# Altium project [MarvBit]STM32_BLDC_ESC.PrjPcb
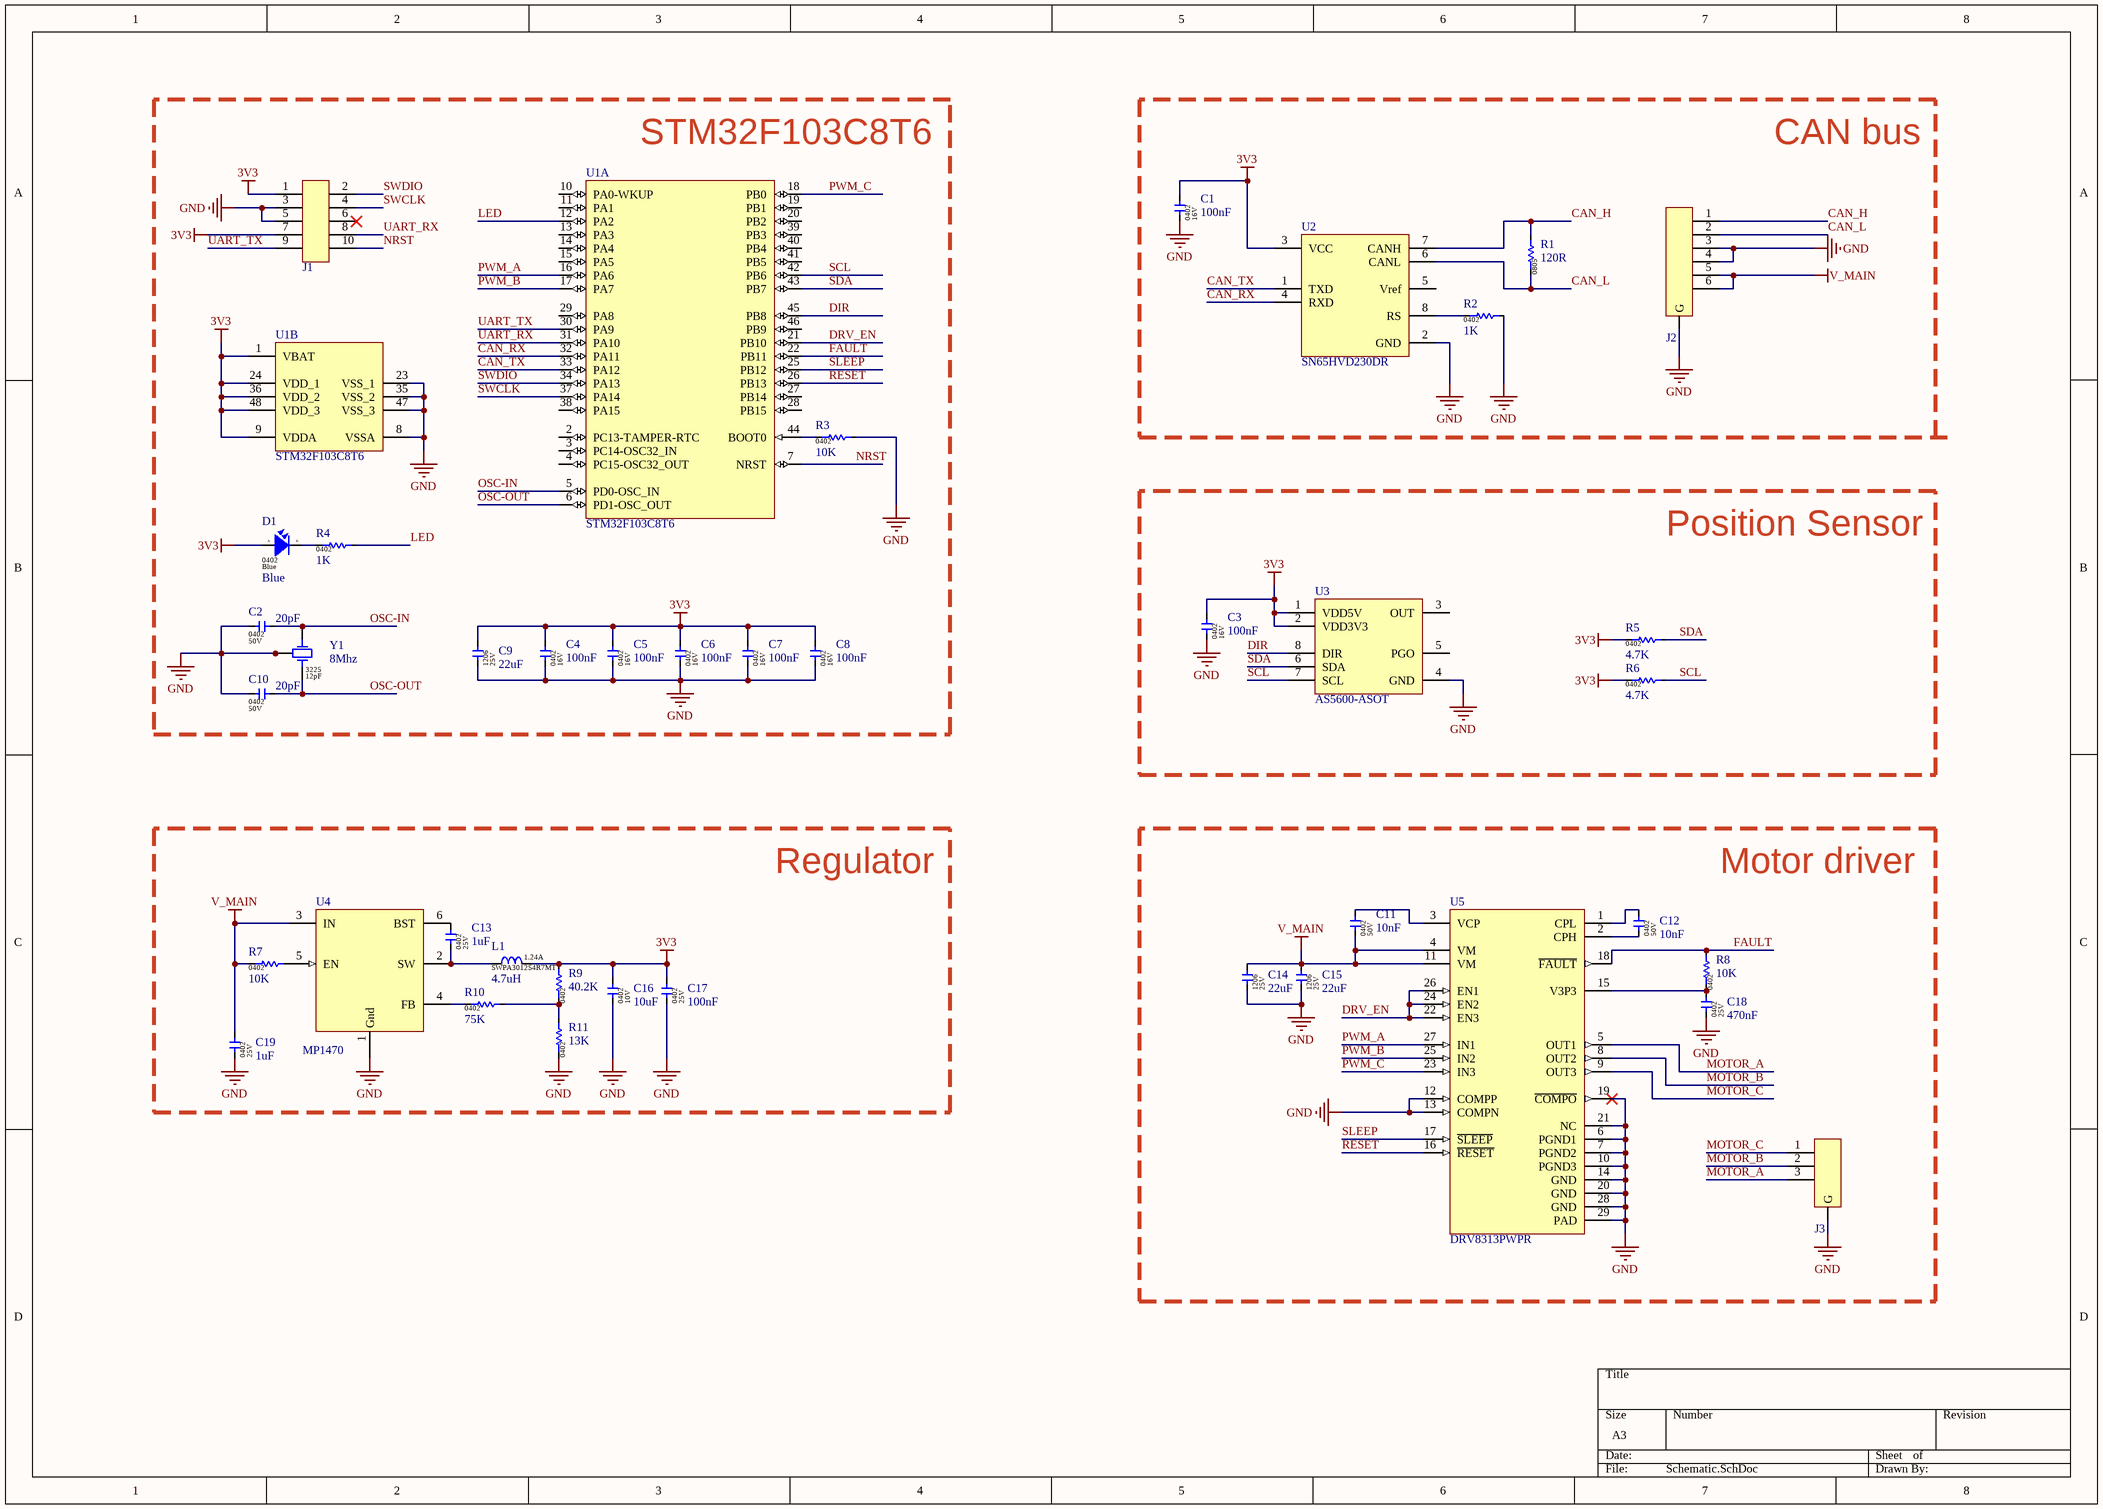
[diagram p0: Schematic.SchDoc]
1 sheet, 41 parts. Net scope: global (net labels, ports and power ports of the same name join across sheets).
Board file: PCB layout.PcbDoc

## Sheet Schematic.SchDoc
size A3; SheetNumber: 1; SheetTotal: 1

### Parts
C1  100nF  [CAP-0402]
C2  20pF  [CAP-0402]
C3  100nF  [CAP-0402]
C4  100nF  [CAP-0402]
C5  100nF  [CAP-0402]
C6  100nF  [CAP-0402]
C7  100nF  [CAP-0402]
C8  100nF  [CAP-0402]
C9  22uF  [CAP-1206]
C10  20pF  [CAP-0402]
C11  10nF  [CAP-0402]
C12  10nF  [CAP-0402]
C13  1uF  [CAP-0402]
C14  22uF  [CAP-1206]
C15  22uF  [CAP-1206]
C16  10uF  [CAP-0402]
C17  100nF  [CAP-0402]
C18  470nF  [CAP-0402]
C19  1uF  [CAP-0402]
D1  Blue  [LED-0402 BLUE]
J1  X1270WVS-2x05B-6TV01  [SMD_IDC_1.27_10P]  (value not drawn)
J2  1.25T-6P-WT  [Conn MX1.25 (6)]  (value not drawn)
J3  1.25T-3P-WT  [Conn MX1.25 (3)]  (value not drawn)
L1  4.7uH  [IND-3012]
R1  120R  [RES-0805]
R2  1K  [RES-0402]
R3  10K  [RES-0402]
R4  1K  [RES-0402]
R5  4.7K  [RES-0402]
R6  4.7K  [RES-0402]
R7  10K  [RES-0402]
R8  10K  [RES-0402]
R9  40.2K  [RES-0402]
R10  75K  [RES-0402]
R11  13K  [RES-0402]
U1  STM32F103C8T6  [ST LQFP-48 7x7MM]  (parts A,B of 2)
U2  SN65HVD230DR  [SOP-8]
U3  AS5600-ASOT  [SOP-8]
U4  MP1470  [SOT23-6]
U5  DRV8313PWPR  [TSSOP-28_PAD]
Y1  8Mhz  [Crystal-3225]

### Blocks framed on the sheet
STM32F103C8T6: C2 C4-C10 D1 J1 R3 R4 U1 Y1
Position Sensor: C3 R5 R6 U3
Regulator: C13 C16 C17 C19 L1 R7 R9-R11 U4
Motor driver: C11 C12 C14 C15 C18 J3 R8 U5

### Nets
3V3: C1.2 C3.2 C4.2 C5.2 C6.2 C7.2 C8.2 C9.2 C16.2 C17.2 D1.2(Anode) J1.1 J1.7 L1.2 R5.1 R6.1 R9.2 U1.1(VBAT) U1.9(VDDA) U1.24(VDD_1) U1.36(VDD_2) U1.48(VDD_3) U2.3(VCC) U3.1(VDD5V) U3.2(VDD3V3)
GND: C1.1 C2.1 C3.1 C4.1 C5.1 C6.1 C7.1 C8.1 C9.1 C10.1 C14.1 C15.1 C16.1 C17.1 C18.1 C19.1 J1.3 J1.5 J2.0(G) J2.3 J2.4 J3.0(G) R2.2 R3.2 R11.1 U1.8(VSSA) U1.23(VSS_1) U1.35(VSS_2) U1.47(VSS_3) U2.2(GND) U3.4(GND) U4.1(Gnd) U5.6(PGND1) U5.7(PGND2) U5.10(PGND3) U5.12(COMPP) U5.13(COMPN) U5.14(GND) U5.19(~{COMPO}) U5.20(GND) U5.21(NC) U5.28(GND) U5.29(PAD) Y1.2(GND) Y1.4(GND)
V_MAIN: C11.1 C14.2 C15.2 C19.2 J2.5 J2.6 R7.1 U4.3(IN) U5.4(VM) U5.11(VM)
CAN_H: J2.1 R1.2 U2.7(CANH)
CAN_L: J2.2 R1.1 U2.6(CANL)
CAN_RX: U1.32(PA11) U2.4(RXD)
CAN_TX: U1.33(PA12) U2.1(TXD)
DIR: U1.45(PB8) U3.8(DIR)
DRV_EN: U1.21(PB10) U5.22(EN3) U5.24(EN2) U5.26(EN1)
FAULT: R8.2 U1.22(PB11) U5.18(~{FAULT})
LED: R4.2 U1.12(PA2)
MOTOR_A: J3.3 U5.5(OUT1)
MOTOR_B: J3.2 U5.8(OUT2)
MOTOR_C: J3.1 U5.9(OUT3)
NRST: J1.10 U1.7(NRST)
OSC-IN: C2.2 U1.5(PD0-OSC_IN) Y1.1(X1)
OSC-OUT: C10.2 U1.6(PD1-OSC_OUT) Y1.3(X2)
PWM_A: U1.16(PA6) U5.27(IN1)
PWM_B: U1.17(PA7) U5.25(IN2)
PWM_C: U1.18(PB0) U5.23(IN3)
RESET: U1.26(PB13) U5.16(~{RESET})
SCL: R6.2 U1.42(PB6) U3.7(SCL)
SDA: R5.2 U1.43(PB7) U3.6(SDA)
SLEEP: U1.25(PB12) U5.17(~{SLEEP})
SWCLK: J1.4 U1.37(PA14)
SWDIO: J1.2 U1.34(PA13)
UART_RX: J1.8 U1.31(PA10)
UART_TX: J1.9 U1.30(PA9)
NetC11_2: C11.2 U5.3(VCP)
NetC12_1: C12.1 U5.2(CPH)
NetC12_2: C12.2 U5.1(CPL)
NetC13_1: C13.1 L1.1 U4.2(SW)
NetC13_2: C13.2 U4.6(BST)
NetC18_2: C18.2 R8.1 U5.15(V3P3)
NetD1_1: D1.1(Cathode) R4.1
NetR2_1: R2.1 U2.8(RS)
NetR3_1: R3.1 U1.44(BOOT0)
NetR7_2: R7.2 U4.5(EN)
NetR9_1: R9.1 R10.2 R11.2
NetR10_1: R10.1 U4.4(FB)

Not connected (* = marked no-connect by the designer): J1 6*; U1 2(PC13-TAMPER-RTC) 3(PC14-OSC32_IN) 4(PC15-OSC32_OUT) 10(PA0-WKUP) 11(PA1) 13(PA3) 14(PA4) 15(PA5) 19(PB1) 20(PB2) 27(PB14) 28(PB15) 29(PA8) 38(PA15) 39(PB3) 40(PB4) 41(PB5) 46(PB9); U2 5(Vref); U3 3(OUT) 5(PGO)

### Notes on the sheet
- CAN bus
- (in symbol 0402-blue) A; K

### Library data of the parts
C1 C3-C8 = 0402B104K160CT: 100nF ±10% 16V X7R 0402 Multilayer Ceramic Capacitors MLCC - SMD/SMT RoHS; Manufacture: WALSIN; Package / Case: 0402; Component type: Capacitor; Manufacture part: 0402B104K160CT; Capacitor value: 100nF; Voltage: 16V; Package: 0402
C2 C10 = CL05C200JB5NNNC: 20 pF ±5% 50V Ceramic Capacitor C0G, NP0 0402 (1005 Metric); Manufacture: Samsung; Package / Case: 0402; Component type: Capacitor; Manufacture part: CL05C200JB5NNNC; Capacitor value: 20pF; Voltage: 50V; Package: 0402
C9 C14 C15 = CL31A226KAHNNNE: X5R 25V ±10% 22uF 1206 Multilayer Ceramic Capacitors MLCC - SMD/SMT ROHS; Manufacture: Samsung; Package / Case: 0402; Component type: Capacitor; Manufacture part: CL31A226KAHNNNE; Capacitor value: 22uF; Voltage: 25V; Package: 1206
C11 C12 = 0402B103J500CT: 10nF ±5% 50V X7R 0402 Multilayer Ceramic Capacitors MLCC - SMD/SMT RoHS; Manufacture: WALSIN; Package / Case: 0402; Component type: Capacitor; Manufacture part: 0402B103J500CT; Capacitor value: 10nF; Voltage: 50V; Package: 0402
C13 C19 = 0402X105K250CT: 25V 1uF X5R ±10% 0402 Multilayer Ceramic Capacitors MLCC - SMD/SMT ROHS; Manufacture: WALSIN; Package / Case: 0402; Component type: Capacitor; Manufacture part: 0402X105K250CT; Capacitor value: 1uF; Voltage: 25V; Package: 0402
C16 = CL05A106MP5NUNC: 10V 10uF X5R ±20% 0402 Multilayer Ceramic Capacitors MLCC - SMD/SMT ROHS; Manufacture: Samsung; Package / Case: 0402; Component type: Capacitor; Manufacture part: CL05A106MP5NUNC; Capacitor value: 10uF; Voltage: 10V; Package: 0402
C17 = 0402X104K250CT: 100nF ±10% 25V X5R 0402 Multilayer Ceramic Capacitors MLCC - SMD/SMT RoHS; Manufacture: WALSIN; Package / Case: 0402; Component type: Capacitor; Manufacture part: 0402X104K250CT; Capacitor value: 100nF; Voltage: 25V; Package: 0402
C18 = 0402X474K250CT: 470nF X5R 25V ±10% 470nF 0402 Multilayer Ceramic Capacitors MLCC - SMD/SMT ROHS; Manufacture: WALSIN; Package / Case: 0402; Component type: Capacitor; Manufacture part: 0402X474K250CT; Capacitor value: 470nF; Voltage: 25V; Package: 0402
D1 = 0402-blue: Blue 0402 Light Emitting Diodes (LED) ROHS; Manufacture: XINGLIGHT; Package / Case: 0402; Component type: Led; Part reference: *; Manufacture part: 0402-blue; Color: Blue; Package: 0402
J1 = X1270WVS-2x05B-6TV01: SMD,P=1.27mm IDC Connectors ROHS; Manufacture: XKB Connectivity; Manufacture part: X1270WVS-2x05B-6TV01; Type: Pin Header; Datasheet: https://datasheet.lcsc.com/lcsc/2201191230_XKB-Connectivity-X1270WVS-2x05B-6TV01_C2962219.pdf
J2 = 1.25T-6P-WT: MX1.25 Header Male Pin 0.049"(1.25mm) 6 P=1.25mm Wire To Board / Wire To Wire Connector RoHS; Manufacture: Korean Hroparts Elec; Manufacture part: 1.25T-6P-WT; Type: MX1.25; Datasheet: https://datasheet.lcsc.com/lcsc/1811151526_Korean-Hroparts-Elec-1-25T-6P-WT_C97377.pdf
J3 = 1.25T-3P-WT: MX1.25 Header Male Pin 0.049"(1.25mm) 3 SMD,P=1.25mm Wire To Board / Wire To Wire Connector RoHS; Manufacture: Korean Hroparts Elec; Manufacture part: 1.25T-3P-WT; Type: MX1.25; Datasheet: https://datasheet.lcsc.com/lcsc/2008221834_Korean-Hroparts-Elec-1-25T-3P-WT_C707315.pdf
L1 = SWPA3012S4R7MT: Inductor 30x30x12, 4.7±20% , 1.24A; Manufacture: SUNLORD; DCR: 0.12 Ω; Manufacture part: SWPA3012S4R7MT; Inductance value: 4.7uH; Irms max: 1.24A; Package: 3012
R1 = AC0805FR-7W120RL: 250mW Thick Film Resistors 150V ±100ppm/℃ ±1% -55℃~+155℃ 120Ω 0805 Chip Resistor - Surface Mount ROHS; Manufacture: YAGEO; Package / Case: 0201; Component type: Resistor; Manufacture part: AC0805FR-7W120RL; Resistor value: 120R; Package: 0805
R2 R4 = WR04X1001FTL: 1kΩ ±1% 1/16W ±100ppm/℃ 0402 Chip Resistor - Surface Mount RoHS; Manufacture: WALSIN; Package / Case: 0201; Component type: Resistor; Manufacture part: WR04X1001FTL; Resistor value: 1K; Package: 0402
R3 R7 R8 = WR04X1002FTL: 10kΩ ±1% 1/16W ±100ppm/℃ 0402 Chip Resistor - Surface Mount RoHS; Manufacture: WALSIN; Package / Case: 0201; Component type: Resistor; Manufacture part: WR04X1002FTL; Resistor value: 10K; Package: 0402
R5 R6 = WR04X4701FTL: 4.7kΩ ±1% 1/16W ±100ppm/℃ 0402 Chip Resistor - Surface Mount RoHS; Manufacture: WALSIN; Package / Case: 0201; Component type: Resistor; Manufacture part: WR04X4701FTL; Resistor value: 4.7K; Package: 0402
R9 = RC0402FR-0740K2L: 62.5mW Thick Film Resistors ±1% 40.2kΩ 0402 Chip Resistor - Surface Mount ROHS; Manufacture: YAGEO; Package / Case: 0201; Component type: Resistor; Manufacture part: RC0402FR-0740K2L; Resistor value: 40.2K; Package: 0402
R10 = WR04X7502FTL: 75kΩ ±1% 1/16W ±100ppm/℃ 0402 Chip Resistor - Surface Mount RoHS; Manufacture: WALSIN; Package / Case: 0201; Component type: Resistor; Manufacture part: WR04X7502FTL; Resistor value: 75K; Package: 0402
R11 = RC0402FR-0713KL: 62.5mW Thick Film Resistors ±100ppm/℃ ±1% 13kΩ 0402 Chip Resistor - Surface Mount ROHS; Manufacture: YAGEO; Package / Case: 0201; Component type: Resistor; Manufacture part: RC0402FR-0713KL; Resistor value: 13K; Package: 0402
U1 = STM32F103C8T6: 32-Bit FLASH ARM® Cortex®-M3 72MHz 2V ~ 3.6V LQFP-48_7x7x05P ST Microelectronics RoHS; ComponentLink2Description: Datasheet; ComponentLink2URL: http://www.st.com/st-web-ui/static/active/en/resource/technical/document/datasheet/CD00161566.pdf; Package / Case: LQFP-48; Component type: Microcontroller; Manufacture part: STM32F103C8T6; Manufacture: STMicroelectronics; Package: LQFP-48; Datasheet: https://datasheet.lcsc.com/lcsc/1811151642_STMicroelectronics-STM32F103C8T6_C8734.pdf
U2 = SN65HVD230DR: 3.3-V CAN Bus Transceivers; Manufacture: Texas Instruments; Manufacture part: SN65HVD230DR; Package: SOP-8; Datasheet: https://www.ti.com/lit/ds/symlink/sn65hvd230.pdf?ts=1662996416638
U3 = AS5600-ASOT: 0°~360° SOP-8 Position Sensor ROHS; Manufacture: AMS; Manufacture part: AS5600-ASOT; Package: SOP-8; Datasheet: https://datasheet.lcsc.com/lcsc/2304140030_AMS-AS5600-ASOT_C499458.pdf
U4 = MP1470: High-Efficiency, 2A, 16V, 500kHz Synchronous, Step-Down Converter In a 6-Pin TSOT 23; Manufacture: Advanced Monolithic Systems; Manufacture part: MP1470; Type: Buck; Package: SOT23-6; Datasheet: https://www.monolithicpower.com/en/documentview/productdocument/index/version/2/document_type/Datasheet/lang/en/sku/MP1470/document_id/327/
U5 = DRV8313PWPR: BLDC 8V~60V Parallel TSSOP-28-EP Motor Driver ICs ROHS; Manufacture: Texas Instruments; Manufacture part: DRV8313PWPR; Package: TSSOP-28-EP; Datasheet: https://datasheet.lcsc.com/lcsc/1809141420_Texas-Instruments-DRV8313PWPR_C92482.pdf
Y1 = X3S008000BK1H-U: 8MHz ±10ppm 20pF 400Ω SMD,3.2x2.5mm Crystals RoHS; Manufacture: HELE(Harmony Elec); Load capacitance: 12pF; Manufacture part: X3S008000BK1H-U; Crystal value: 8Mhz; Package: 3225